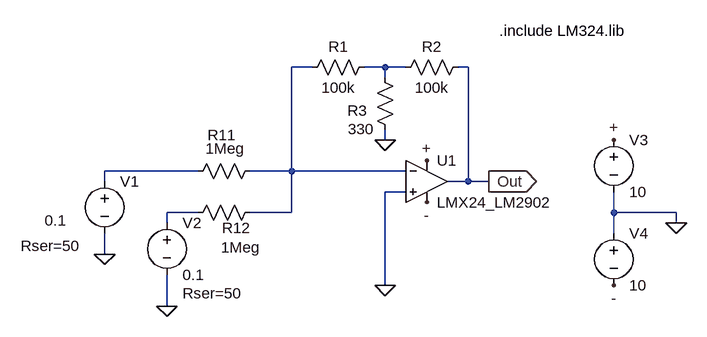
[diagram p0: schematic circuito_Vos.asc]
circuito_Vos.asc, the LTspice schematic file:
Version 4.1
SHEET 1 880 680
WIRE 16 -64 -16 -64
WIRE 128 -64 96 -64
WIRE 160 -64 128 -64
WIRE 256 -64 240 -64
WIRE 128 -48 128 -64
WIRE 128 48 128 32
WIRE -160 96 -304 96
WIRE -16 96 -16 -64
WIRE -16 96 -80 96
WIRE 160 96 -16 96
WIRE -304 112 -304 96
WIRE 256 112 256 -64
WIRE 256 112 224 112
WIRE 288 112 256 112
WIRE 160 128 128 128
WIRE -160 160 -208 160
WIRE -16 160 -16 96
WIRE -16 160 -80 160
WIRE 480 160 480 128
WIRE 576 160 480 160
WIRE -208 176 -208 160
WIRE 576 176 576 160
WIRE 480 192 480 160
WIRE -304 224 -304 192
WIRE 128 272 128 128
WIRE -208 304 -208 256
FLAG 288 112 Out
IOPIN 288 112 Out
FLAG 192 80 +
FLAG 192 144 -
FLAG 480 48 +
FLAG 480 272 -
FLAG -304 224 0
FLAG -208 304 0
FLAG 576 176 0
FLAG 128 48 0
FLAG 128 272 0
SYMBOL OpAmps\\opamp2 192 48 R0
SYMATTR InstName U1
SYMATTR Value LMX24_LM2902
SYMBOL res -64 80 R90
WINDOW 0 -24 59 VBottom 2
WINDOW 3 -3 54 VBottom 2
SYMATTR InstName R11
SYMATTR Value 1Meg
SYMBOL res -64 144 R90
WINDOW 0 55 37 VBottom 2
WINDOW 3 85 30 VBottom 2
SYMATTR InstName R12
SYMATTR Value 1Meg
SYMBOL voltage 480 32 R0
WINDOW 123 0 0 Left 0
WINDOW 39 0 0 Left 0
SYMATTR InstName V3
SYMATTR Value 10
SYMBOL voltage 480 176 R0
WINDOW 123 0 0 Left 0
WINDOW 39 0 0 Left 0
SYMATTR InstName V4
SYMATTR Value 10
SYMBOL res 112 -80 R90
WINDOW 0 0 56 VBottom 2
WINDOW 3 32 56 VTop 2
SYMATTR InstName R1
SYMATTR Value 100k
SYMBOL res 256 -80 R90
WINDOW 0 0 56 VBottom 2
WINDOW 3 32 56 VTop 2
SYMATTR InstName R2
SYMATTR Value 100k
SYMBOL res 144 48 R180
WINDOW 0 43 45 Left 2
WINDOW 3 33 17 Left 2
SYMATTR InstName R3
SYMATTR Value 330
SYMBOL voltage -304 96 R0
WINDOW 3 -92 76 Left 2
WINDOW 123 0 0 Left 0
WINDOW 39 -129 115 Left 2
SYMATTR InstName V1
SYMATTR Value 0.1
SYMATTR SpiceLine Rser=50
SYMBOL voltage -208 160 R0
WINDOW 123 0 0 Left 0
WINDOW 39 24 124 Left 2
SYMATTR InstName V2
SYMATTR Value 0.1
SYMATTR SpiceLine Rser=50
TEXT 304 -120 Left 2 !.include LM324.lib

The netlist it stands for:
* circuito_Vos.asc
X§U1 0 N001 + - Out LMX24_LM2902  ; pins In+ In- V+ V- OUT
R11 N001 N003 1Meg
R12 N001 N004 1Meg
V3 + 0 10
V4 0 - 10
R1 N002 N001 100k
R2 Out N002 100k
R3 0 N002 330
V1 N003 0 0.1 Rser=50
V2 N004 0 0.1 Rser=50
.include LM324.lib
.backanno
.end